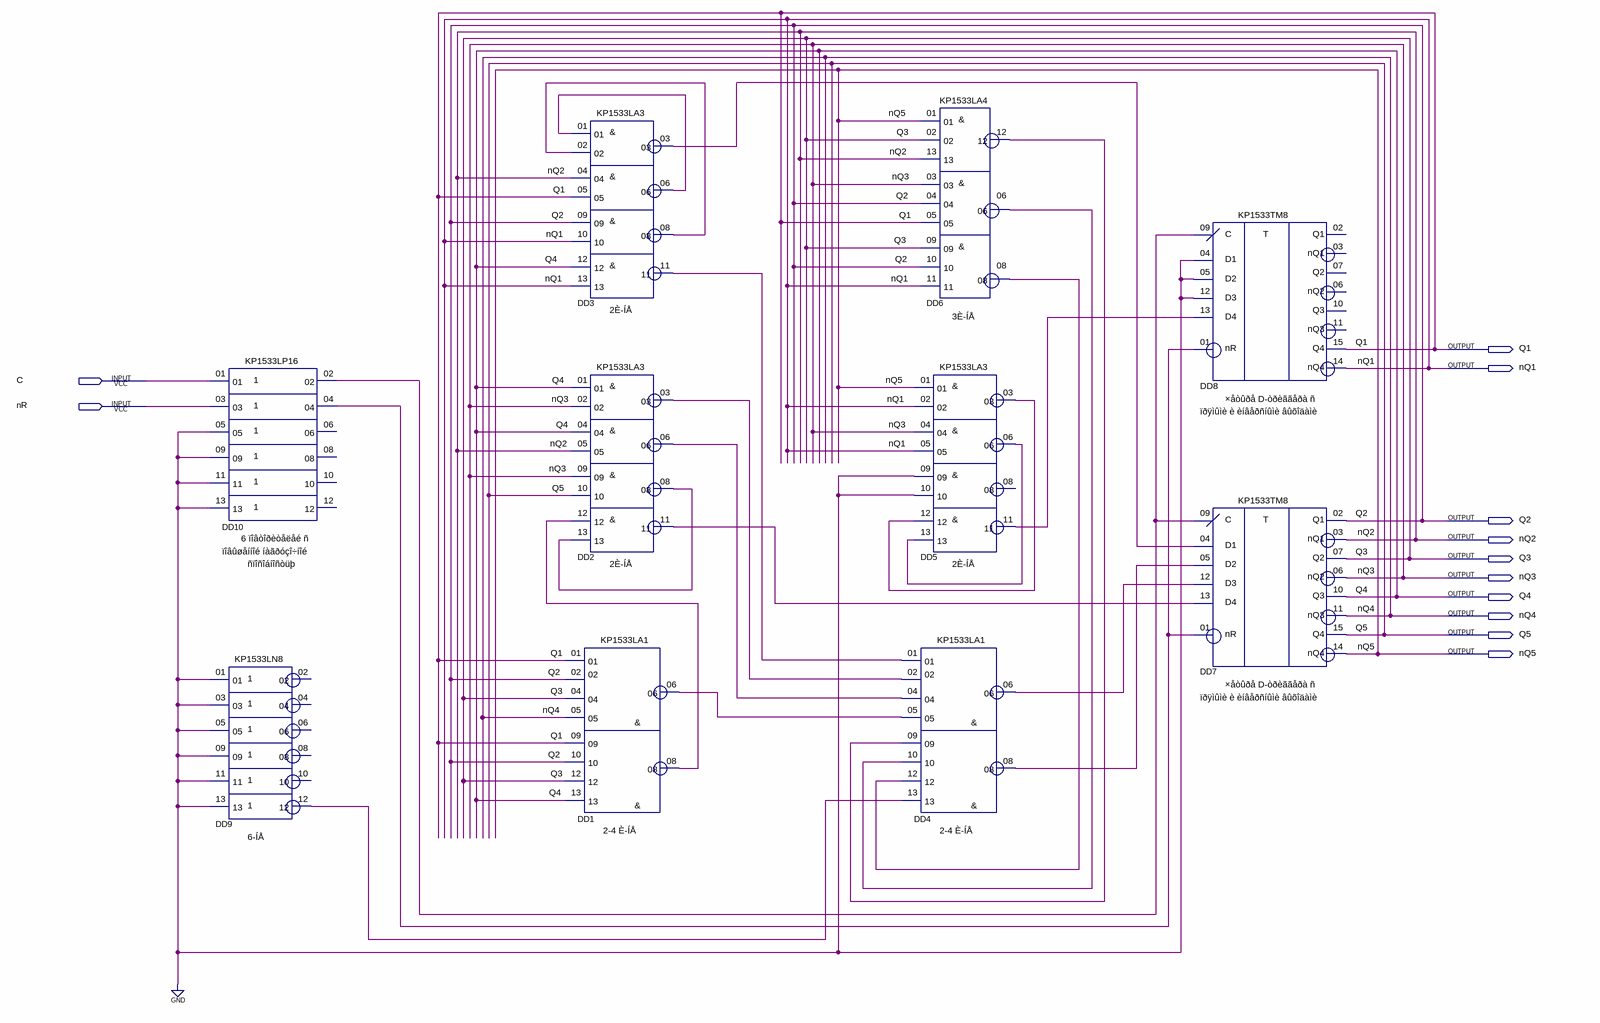
[diagram p0: schematic sheet]
// Quartus schematic BinaryCounterDFF.bdf as structural Verilog: 10 symbols, 12 pins
module BinaryCounterDFF (
  input  C,
  input  nR,
  output Q1,
  output nQ1,
  output Q2,
  output nQ2,
  output Q3,
  output nQ3,
  output Q4,
  output nQ4,
  output Q5,
  output nQ5
);

  wire DD1_06, DD1_08, DD2_03, DD2_06, DD2_08, DD2_11, DD3_03, DD3_06, DD3_08, DD3_11, DD4_06, DD4_08,
       DD5_03, DD5_06, DD5_11, DD6_06, DD6_08, DD6_12, DD9_12, DD10_02, DD10_04;

  KP1533LP16 DD10 (
    .\01 (C), .\03 (nR), .\05 (1'b0), .\09 (1'b0), .\11 (1'b0), .\13 (1'b0), .\02 (DD10_02), .\04 (DD10_04));  // open: 06, 08, 10, 12
  KP1533LN8 DD9 (
    .\01 (1'b0), .\03 (1'b0), .\05 (1'b0), .\09 (1'b0), .\11 (1'b0), .\13 (1'b0), .\12 (DD9_12));  // open: 02, 04, 06, 08, 10
  KP1533LA3 DD3 (
    .\01 (DD3_06), .\02 (DD3_08), .\04 (nQ2), .\05 (Q1), .\09 (Q2), .\10 (nQ1), .\12 (Q4), .\13 (nQ1),
    .\03 (DD3_03), .\06 (DD3_06), .\08 (DD3_08), .\11 (DD3_11));
  KP1533LA3 DD2 (
    .\01 (Q4), .\02 (nQ3), .\04 (Q4), .\05 (nQ2), .\09 (nQ3), .\10 (Q5), .\12 (DD1_08), .\13 (DD2_08),
    .\03 (DD2_03), .\06 (DD2_06), .\08 (DD2_08), .\11 (DD2_11));
  KP1533LA1 DD1 (
    .\01 (Q1), .\02 (Q2), .\04 (Q3), .\05 (nQ4), .\09 (Q1), .\10 (Q2), .\12 (Q3), .\13 (Q4), .\06 (DD1_06),
    .\08 (DD1_08));
  KP1533LA1 DD4 (
    .\01 (DD3_11), .\02 (DD2_03), .\04 (DD2_06), .\05 (DD1_06), .\09 (DD6_12), .\10 (DD6_06), .\12 (DD6_08),
    .\13 (DD9_12), .\06 (DD4_06), .\08 (DD4_08));
  KP1533LA4 DD6 (
    .\01 (nQ5), .\02 (Q3), .\13 (nQ2), .\03 (nQ3), .\04 (Q2), .\05 (Q1), .\09 (Q3), .\10 (Q2), .\11 (nQ1),
    .\12 (DD6_12), .\06 (DD6_06), .\08 (DD6_08));
  KP1533LA3 DD5 (
    .\01 (nQ5), .\02 (nQ1), .\04 (nQ3), .\05 (nQ1), .\09 (1'b0), .\10 (1'b0), .\12 (DD5_03), .\13 (DD5_06),
    .\03 (DD5_03), .\06 (DD5_06), .\11 (DD5_11));  // open: 08
  KP1533TM8 DD8 (
    .nR(DD10_04), .C(DD10_02), .D1(1'b0), .D2(1'b0), .D3(1'b0), .D4(DD5_11), .Q4(Q1), .nQ4(nQ1));  // open: Q1, nQ1, Q2, nQ2, Q3, nQ3
  KP1533TM8 DD7 (
    .nR(DD10_04), .C(DD10_02), .D1(DD3_03), .D2(DD4_08), .D3(DD4_06), .D4(DD2_11), .Q1(Q2), .nQ1(nQ2),
    .Q2(Q3), .nQ2(nQ3), .Q3(Q4), .nQ3(nQ4), .Q4(Q5), .nQ4(nQ5));
endmodule
